# EAGLE schematic Schematic Projeto (EAGLE 9.7.0)
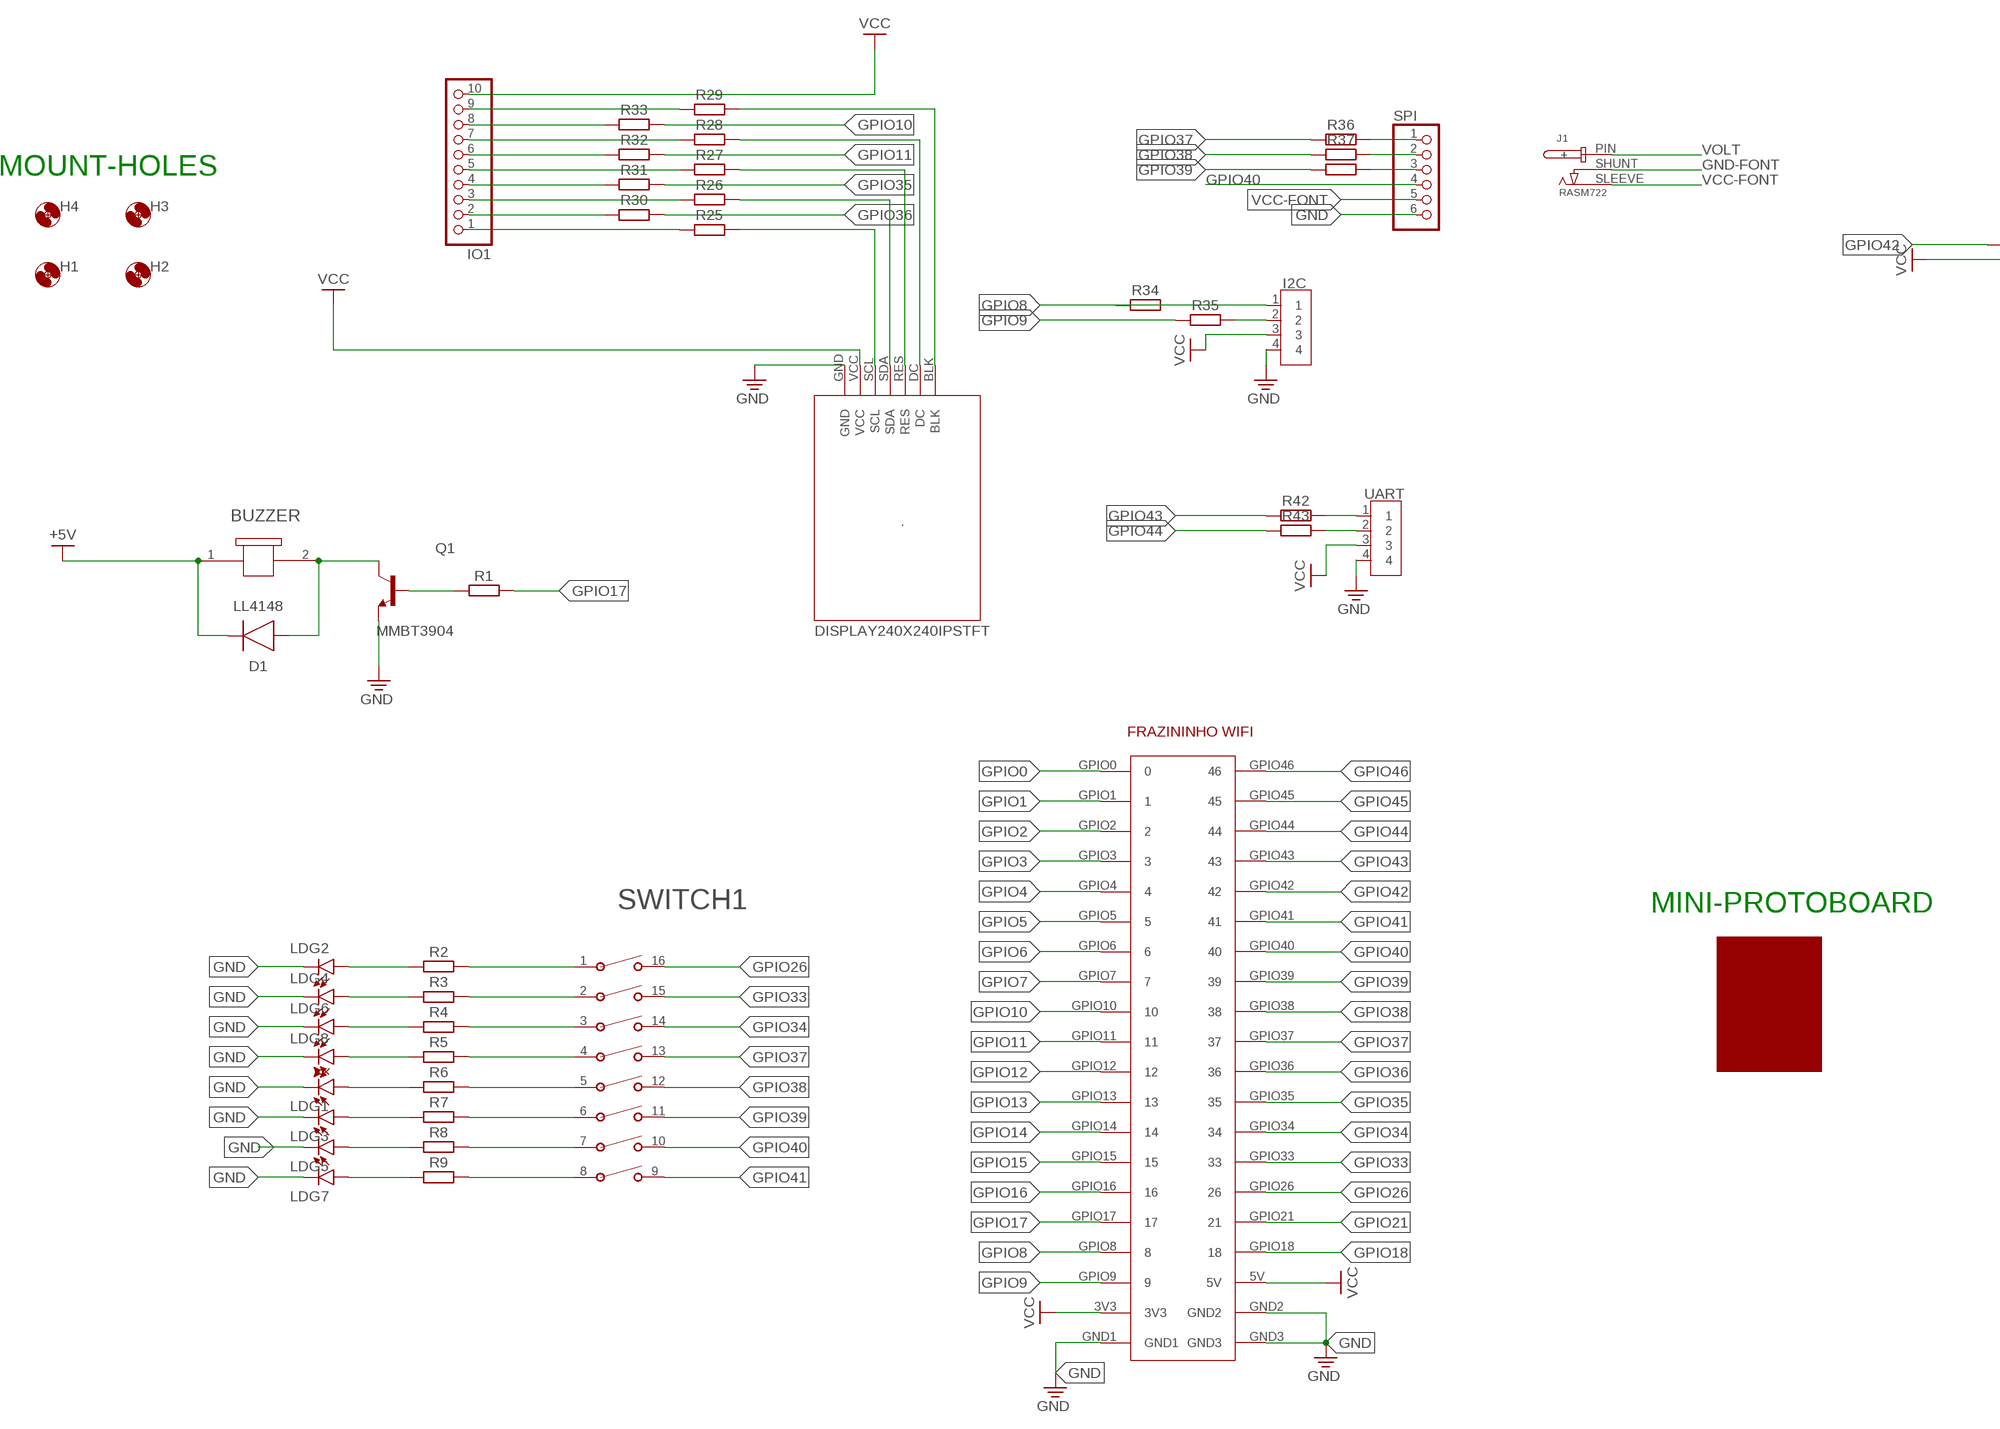
[diagram p0: schematic, sheet 1, part 1 of 2]
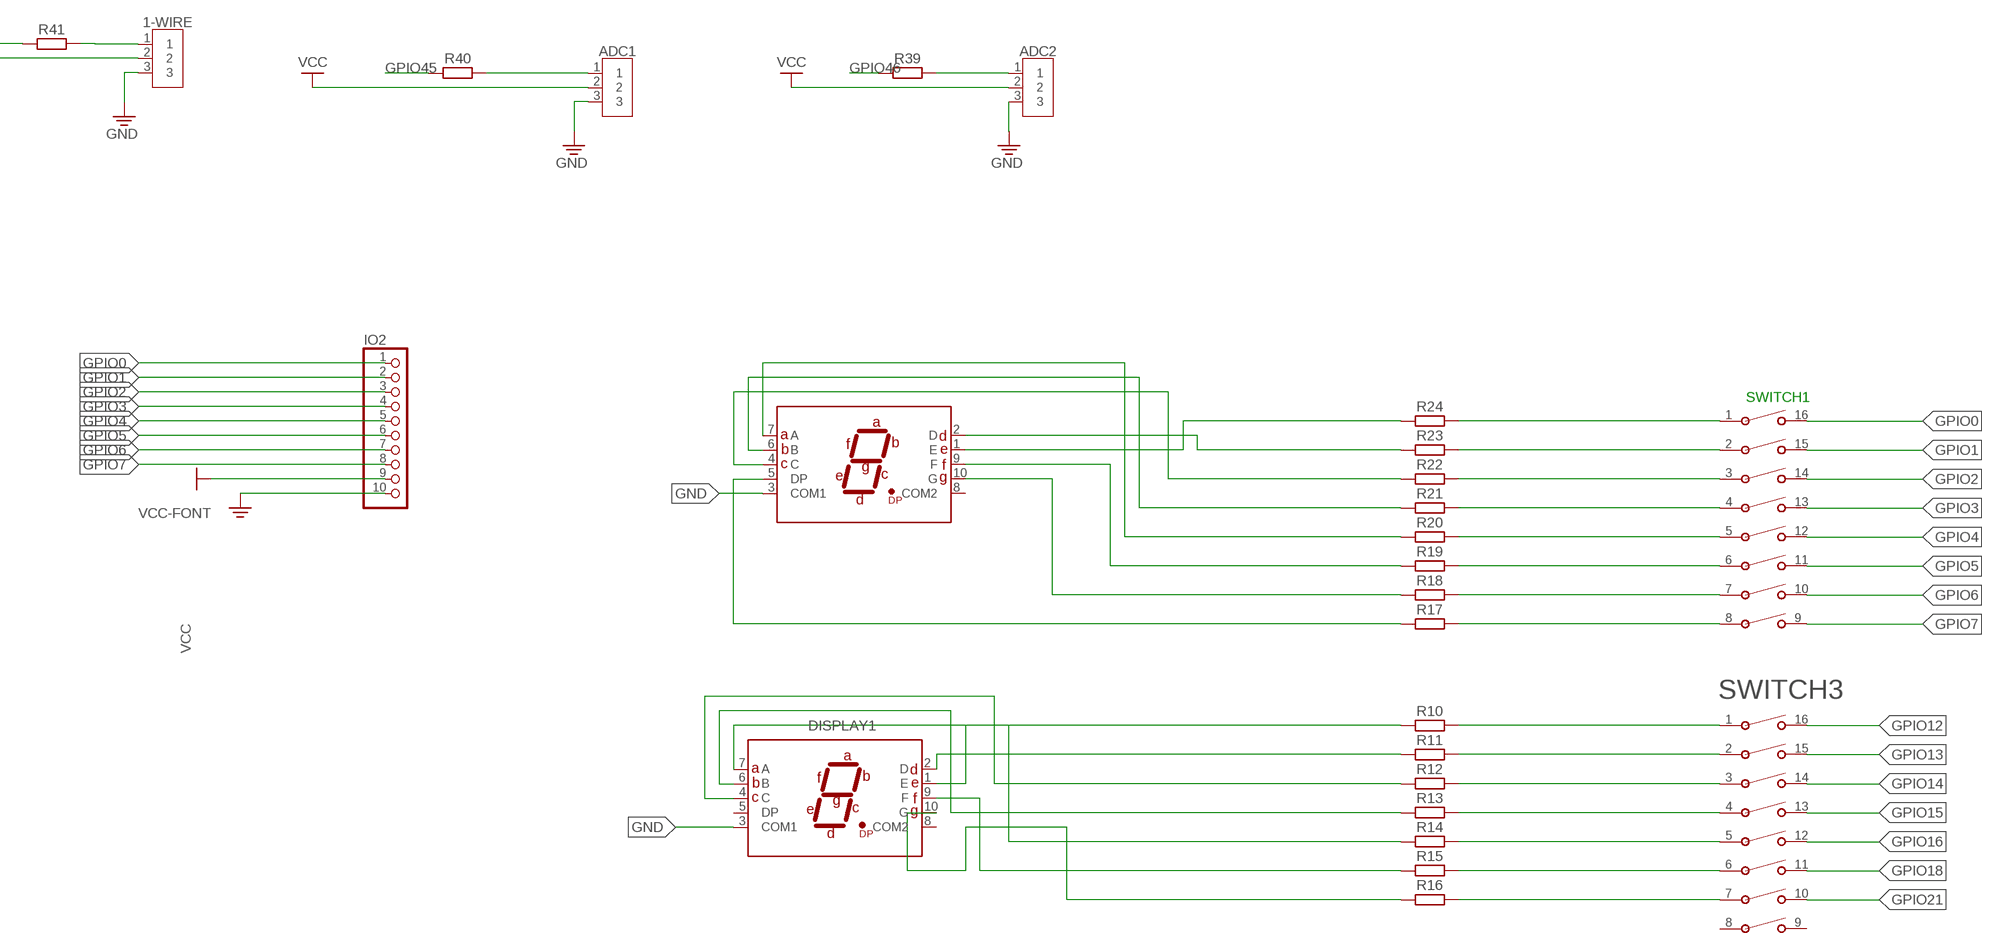
[diagram p1: schematic, sheet 1, part 2 of 2]

## Parts
1-WIRE  2828XX-3282834-3  [TERMBLK_254-3N]
.  DISPLAY240X240IPSTFT  [TFT]
ADC1  2828XX-3282834-3  [TERMBLK_254-3N]
ADC2  2828XX-3282834-3  [TERMBLK_254-3N]
BUZZER  PB-09N23P-03QPB-09N23P-03Q_MAL  [PB-09N23P-03Q_MAL]
D1  LL4148  DIODE_LL4148_SOD-80  [DIOMELF3516]
DISPLAY1  ACSA03-41  ACSA03-41SRWA-F01  [ACSA0341SRWAF01]
DISPLAY2  ACSA03-41  ACSA03-41SRWA-F01  [ACSA0341SRWAF01]
H1  MOUNT-HOLE2.2  [2,2]
H2  MOUNT-HOLE2.2  [2,2]
H3  MOUNT-HOLE2.2  [2,2]
H4  MOUNT-HOLE2.2  [2,2]
I2C  2828XX-4282837-4  [TERMBLK_508-4N]
IO1  PINHD-1X10  [1X10]
IO2  PINHD-1X10  [1X10]
J1  RASM722  [RASM722X]
LDG1  LED_RADIALGREEN  [LEDGR254W60D565H860B_Y]
LDG2  LED_RADIALGREEN  [LEDGR254W60D565H860B_Y]
LDG3  LED_RADIALGREEN  [LEDGR254W60D565H860B_Y]
LDG4  LED_RADIALGREEN  [LEDGR254W60D565H860B_Y]
LDG5  LED_RADIALGREEN  [LEDGR254W60D565H860B_Y]
LDG6  LED_RADIALGREEN  [LEDGR254W60D565H860B_Y]
LDG7  LED_RADIALGREEN  [LEDGR254W60D565H860B_Y]
LDG8  LED_RADIALGREEN  [LEDGR254W60D565H860B_Y]
Q1  MMBT3904  [SOT23]
R1  R_CHIP-0603(1608-METRIC)  [RESC1608X60]
R2  R_CHIP-0603(1608-METRIC)  [RESC1608X60]
R3  R_CHIP-0603(1608-METRIC)  [RESC1608X60]
R4  R_CHIP-0603(1608-METRIC)  [RESC1608X60]
R5  R_CHIP-0603(1608-METRIC)  [RESC1608X60]
R6  R_CHIP-0603(1608-METRIC)  [RESC1608X60]
R7  R_CHIP-0603(1608-METRIC)  [RESC1608X60]
R8  R_CHIP-0603(1608-METRIC)  [RESC1608X60]
R9  R_CHIP-0603(1608-METRIC)  [RESC1608X60]
R10  R_AXIAL-7.2MM-PITCH  [RESAD724W46L381D178B]
R11  R_AXIAL-7.2MM-PITCH  [RESAD724W46L381D178B]
R12  R_AXIAL-7.2MM-PITCH  [RESAD724W46L381D178B]
R13  R_AXIAL-7.2MM-PITCH  [RESAD724W46L381D178B]
R14  R_AXIAL-7.2MM-PITCH  [RESAD724W46L381D178B]
R15  R_AXIAL-7.2MM-PITCH  [RESAD724W46L381D178B]
R16  R_AXIAL-7.2MM-PITCH  [RESAD724W46L381D178B]
R17  R_AXIAL-7.2MM-PITCH  [RESAD724W46L381D178B]
R18  R_AXIAL-7.2MM-PITCH  [RESAD724W46L381D178B]
R19  R_AXIAL-7.2MM-PITCH  [RESAD724W46L381D178B]
R20  R_AXIAL-7.2MM-PITCH  [RESAD724W46L381D178B]
R21  R_AXIAL-7.2MM-PITCH  [RESAD724W46L381D178B]
R22  R_AXIAL-7.2MM-PITCH  [RESAD724W46L381D178B]
R23  R_AXIAL-7.2MM-PITCH  [RESAD724W46L381D178B]
R24  R_AXIAL-7.2MM-PITCH  [RESAD724W46L381D178B]
R25  R_AXIAL-7.2MM-PITCH  [RESAD724W46L381D178B]
R26  R_AXIAL-7.2MM-PITCH  [RESAD724W46L381D178B]
R27  R_AXIAL-7.2MM-PITCH  [RESAD724W46L381D178B]
R28  R_AXIAL-7.2MM-PITCH  [RESAD724W46L381D178B]
R29  R_AXIAL-7.2MM-PITCH  [RESAD724W46L381D178B]
R30  R_AXIAL-7.2MM-PITCH  [RESAD724W46L381D178B]
R31  R_AXIAL-7.2MM-PITCH  [RESAD724W46L381D178B]
R32  R_AXIAL-7.2MM-PITCH  [RESAD724W46L381D178B]
R33  R_AXIAL-7.2MM-PITCH  [RESAD724W46L381D178B]
R34  R_AXIAL-7.2MM-PITCH  [RESAD724W46L381D178B]
R35  R_AXIAL-7.2MM-PITCH  [RESAD724W46L381D178B]
R36  R_AXIAL-7.2MM-PITCH  [RESAD724W46L381D178B]
R37  R_AXIAL-7.2MM-PITCH  [RESAD724W46L381D178B]
R38  R_AXIAL-7.2MM-PITCH  [RESAD724W46L381D178B]
R39  R_AXIAL-7.2MM-PITCH  [RESAD724W46L381D178B]
R40  R_AXIAL-7.2MM-PITCH  [RESAD724W46L381D178B]
R41  R_AXIAL-7.2MM-PITCH  [RESAD724W46L381D178B]
R42  R_AXIAL-7.2MM-PITCH  [RESAD724W46L381D178B]
R43  R_AXIAL-7.2MM-PITCH  [RESAD724W46L381D178B]
SPI  PINHD-1X6  [1X06]
SWITCH1  1-1825006-5SWSO16_386X100P100-L  [SWSO16_386X100P100-L]
SWITCH2  1-1825006-5SWSO16_386X100P100-L  [SWSO16_386X100P100-L]
SWITCH3  1-1825006-5SWSO16_386X100P100-L  [SWSO16_386X100P100-L]
U$1  FRANZININHO-WIFI  [FRANZININHO]
U$2  MINI-PROTOBOARD  [MINI-PROTOBOARD]
UART  2828XX-4282837-4  [TERMBLK_508-4N]

## Nets
+5V: BUZZER.1 D1.1(C)
GND: 1-WIRE.3 ..GND ADC1.3 ADC2.3 DISPLAY1.3(COM1) DISPLAY2.3(COM1) I2C.4 IO2.10 LDG1.2(C) LDG2.2(C) LDG3.2(C) LDG4.2(C) LDG5.2(C) LDG6.2(C) LDG7.2(C) LDG8.2(C) Q1.2(E) SPI.6 U$1.GND1 U$1.GND2 U$1.GND3 UART.4
GND-FONT: J1.SHUNT(-)
GPIO0: IO2.1 SWITCH2.16 U$1.GPIO0
GPIO1: IO2.2 SWITCH2.15 U$1.GPIO1
GPIO2: IO2.3 SWITCH2.14 U$1.GPIO2
GPIO3: IO2.4 SWITCH2.13 U$1.GPIO3
GPIO4: IO2.5 SWITCH2.12 U$1.GPIO4
GPIO5: IO2.6 SWITCH2.11 U$1.GPIO5
GPIO6: IO2.7 SWITCH2.10 U$1.GPIO6
GPIO7: IO2.8 SWITCH2.9 U$1.GPIO7
GPIO8: I2C.1 U$1.GPIO8
GPIO9: R35.1 U$1.GPIO9
GPIO10: R33.2 U$1.GPIO10
GPIO11: R32.2 U$1.GPIO11
GPIO12: SWITCH3.16 U$1.GPIO12
GPIO13: SWITCH3.15 U$1.GPIO13
GPIO14: SWITCH3.14 U$1.GPIO14
GPIO15: SWITCH3.13 U$1.GPIO15
GPIO16: SWITCH3.12 U$1.GPIO16
GPIO17: R1.2 U$1.GPIO17
GPIO18: SWITCH3.11 U$1.GPIO18
GPIO21: SWITCH3.10 U$1.GPIO21
GPIO26: SWITCH1.16 U$1.GPIO26
GPIO33: SWITCH1.15 U$1.GPIO33
GPIO34: SWITCH1.14 U$1.GPIO34
GPIO35: R31.2 U$1.GPIO35
GPIO36: R30.2 U$1.GPIO36
GPIO37: R36.1 SWITCH1.13 U$1.GPIO37
GPIO38: R37.1 SWITCH1.12 U$1.GPIO38
GPIO39: R38.1 SWITCH1.11 U$1.GPIO39
GPIO40: SPI.4 SWITCH1.10 U$1.GPIO40
GPIO41: SWITCH1.9 U$1.GPIO41
GPIO42: R41.1 U$1.GPIO42
GPIO43: R42.1 U$1.GPIO43
GPIO44: R43.1 U$1.GPIO44
GPIO45: R40.1 U$1.GPIO45
GPIO46: R39.1 U$1.GPIO46
N$1: ..SCL R25.2
N$2: BUZZER.2 D1.2(A) Q1.3(C)
N$3: ..SDA R26.2
N$4: Q1.1(B) R1.1
N$5: ..RES R27.2
N$6: R10.2 SWITCH3.1
N$7: ..DC R28.2
N$8: I2C.2 R35.2
N$9: ..BLK R29.2
N$10: DISPLAY2.5(DP) R17.1
N$11: R11.2 SWITCH3.2
N$12: R12.2 SWITCH3.3
N$13: LDG2.1(A) R2.1
N$14: R2.2 SWITCH1.1
N$15: LDG4.1(A) R3.1
N$16: DISPLAY1.1(E) R10.1
N$17: DISPLAY2.1(E) R24.1
N$18: R3.2 SWITCH1.2
N$19: LDG6.1(A) R4.1
N$20: LDG8.1(A) R5.1
N$21: DISPLAY2.2(D) R23.1
N$22: DISPLAY2.4(C) R22.1
N$23: DISPLAY1.2(D) R11.1
N$24: DISPLAY1.4(C) R12.1
N$25: LDG1.1(A) R6.1
N$26: LDG3.1(A) R7.1
N$27: LDG5.1(A) R8.1
N$28: LDG7.1(A) R9.1
N$29: R4.2 SWITCH1.3
N$30: R5.2 SWITCH1.4
N$31: R6.2 SWITCH1.5
N$32: R7.2 SWITCH1.6
N$33: R8.2 SWITCH1.7
N$34: R9.2 SWITCH1.8
N$35: DISPLAY2.6(B) R21.1
N$36: DISPLAY2.7(A) R20.1
N$37: DISPLAY2.9(F) R19.1
N$38: DISPLAY2.10(G) R18.1
N$39: DISPLAY1.6(B) R13.1
N$40: DISPLAY1.7(A) R14.1
N$41: DISPLAY1.9(F) R15.1
N$42: DISPLAY1.10(G) R16.1
N$43: R13.2 SWITCH3.4
N$44: R14.2 SWITCH3.5
N$45: R15.2 SWITCH3.6
N$46: R16.2 SWITCH3.7
N$47: R17.2 SWITCH2.8
N$48: R18.2 SWITCH2.7
N$49: R19.2 SWITCH2.6
N$50: R20.2 SWITCH2.5
N$51: R21.2 SWITCH2.4
N$52: R22.2 SWITCH2.3
N$53: R23.2 SWITCH2.2
N$54: R24.2 SWITCH2.1
N$55: IO1.1 R25.1
N$56: IO1.3 R26.1
N$57: IO1.5 R27.1
N$58: IO1.7 R28.1
N$59: IO1.9 R29.1
N$60: IO1.2 R30.1
N$61: IO1.4 R31.1
N$62: IO1.6 R32.1
N$63: IO1.8 R33.1
N$64: R36.2 SPI.1
N$65: R37.2 SPI.2
N$66: R38.2 SPI.3
N$67: R43.2 UART.2
N$68: ADC2.1 R39.2
N$69: ADC1.1 R40.2
N$70: 1-WIRE.1 R41.2
N$71: R42.2 UART.1
VCC: 1-WIRE.2 ..VCC ADC1.2 ADC2.2 I2C.3 IO1.10 U$1.3V3 U$1.5V UART.3
VCC-FONT: IO2.9 J1.SLEEVE(NEG) SPI.5 ; supply symbol labelled VCC
VOLT: J1.PIN(+)
Unconnected: DISPLAY1.5(DP) DISPLAY1.8(COM2) DISPLAY2.8(COM2) R34.1 R34.2 SWITCH3.8 SWITCH3.9

## Notes on the sheet
- MOUNT-HOLES
- SWITCH1
- MINI-PROTOBOARD

## Library data of the parts
1-WIRE ADC1 ADC2 = Connector:2828XX-3: 3 Position Wire to Board Terminal Block Horizontal with Board Datasheet <https://www.te.com.cn/commerce/DocumentDelivery/DDEController?Action=showdoc&DocId=Catalog+Section%7F1308389_EUROSTYLE_TERMINAL_BLOCKS%7F0607%7Fpdf%7FEnglish%7FENG_CS_1308389_EUROSTYLE_TERMINAL_BLOCKS_0607.pdf%7F2-282837-5>; CATEGORY: Connector; DESCRIPTION: TERM BLK 3P SIDE ENT 2.54mm PCB; MANUFACTURER: TE Connectivity; MPN: 282834-3; OPERATING_TEMPERATURE: -40°C to +105°C; PART_STATUS: Active; ROHS_COMPLIANCE: RoHS Compliant; SERIES: 282834; SUBCATEGORY: Terminal Block; TYPE: Side Wire Entry
. = TFT Display:DISPLAY240X240IPSTFT
BUZZER = buzzer new v2:PB-09N23P-03Q; COPYRIGHT: Copyright (C) 2022 Ultra Librarian. All rights reserved.; MANUFACTURER_PART_NUMBER: PB-09N23P-03Q; MFR_NAME: Mallory Sonalert
D1 = Diode:DIODE_: Diode Rectifier - Popular parts; CATEGORY: Diode; DESCRIPTION: DIODE GEN PURP 100V 200MA SOD80; MANUFACTURER: ON Semiconductor; SUB-CATEGORY: Rectifier
DISPLAY1 DISPLAY2 = Display_LED:ACS*?: Single Digit Numeric Display - 7-SEG, (0.2”, 0.3, 0.4, 0.8”) Character size, RED 10SMD 0.2 inch: Common Anode Datasheet <https://www.kingbrightusa.com/images/catalog/SPEC/ACSA02-41SURKWA-F01.pdf> and Common Cathode Datasheet <https://www.kingbrightusa.com/images/catalog/SPEC/ACSC02-41SURKWA-F01.pdf> 0.3 inch: Common Anode Datasheet <https://www.kingbrightusa.com/images/catalog/SPEC/ACSA03-41SRWA-F01.pdf> and Common Cathode Datasheet <https://www.kingbrightusa.com/images/catalog/SPEC/ACSC03-41SRWA-F01.pdf> 0.4 inch: Common Anode Datasheet <https://www.kingbrightusa.com/images/catalog/SPEC/ACSA04-41SRWA-F01.pdf> and Common Cathode Datasheet <https://www.kingbrightusa.com/images/catalog/SPEC/ACSC04-41SRWA-F01.pdf> 0.8 inch: Common Anode Datasheet <https://www.kingbrightusa.com/images/catalog/SPEC/ACSA08-51SURKWA.pdf> and Common Cathode Datasheet <https://www.kingbrightusa.com/images/catalog/SPEC/ACSC08-51SURKWA.pdf>; CATEGORY: Display; COLOUR: RED; CONFIGURATION: COMMON ANODE; DIGIT: Single; DIGIT_HEIGHT: 0.3inch; MANUFACTURER: Kingbright; MPN: ACSA03-41SRWA-F01; OPERATING_TEMPERATURE: -40°C To +85°C; PART_STATUS: ACTIVE; ROHS_COMPLIANT: COMPLIANT; SERIES: -; SUB_CATEGORY: LED; TYPE: 7-Segment
H1-H4 = holes:MOUNT-HOLE: MOUNTING HOLE with drill center marker
I2C UART = Connector:2828XX-4: 4 Position Wire to Board Terminal Block Horizontal with Board Datasheet <https://www.te.com.cn/commerce/DocumentDelivery/DDEController?Action=showdoc&DocId=Catalog+Section%7F1308389_EUROSTYLE_TERMINAL_BLOCKS%7F0607%7Fpdf%7FEnglish%7FENG_CS_1308389_EUROSTYLE_TERMINAL_BLOCKS_0607.pdf%7F2-282837-5>; CATEGORY: Connector; DESCRIPTION: TERM BLK 4P SIDE ENT 5.08mm PCB; MANUFACTURER: TE Connectivity; MPN: 282837-4; OPERATING_TEMPERATURE: 40°C to +105°C; PART_STATUS: Active; ROHS_COMPLIANCE: RoHS Compliant; SERIES: 283737; SUBCATEGORY: Terminal Block; TYPE: Side Wire Entry
IO1 IO2 = Connector:PINHD-1X10: PIN HEADER; CATEGORY: CONNECTOR; SUB-CATEGORY: PIN-HEADER
J1 = Connector:RASM722: CONN PWR JACK 2.1X5.5MM SOLDER Manufacturer's datasheet <http://www.switchcraft.com/Documents/EDG4.pdf#page=135>; CREATED_BY: PCBLayout.com; DIGI-KEY_PART_NO: RASM722X-ND; MANUFACTURER: Switchcraft Inc.; MPN: RASM722X
LDG1-LDG8 = Library:LED_RADIAL: LED - Generic
Q1 = Transistor:MMBT3904: TRANS NPN 40V 0.2A SOT-23 Manufacturer's datasheet <https://www.onsemi.com/pub/Collateral/PZT3904-D.pdf>; CREATED_BY: PCBLayout.com; DIGIKEY_PART_NUMBER: MMBT3904FSCT-ND; MANUFACTURER: ON Semiconductor; MPN: MMBT3904; PACKAGE: SOT-23-3
R1-R43 = Resistor:R: Resistor Fixed - Generic; CATEGORY: Resistor; SUB-CATEGORY: Fixed
SPI = Connector:PINHD-1X6: PIN HEADER; CATEGORY: CONNECTOR; SUB-CATEGORY: PIN-HEADER
SWITCH1-SWITCH3 = Switches:1-1825006-5; BUILT_BY: EMA_UL_Team; CATEGORY: DIP & SIP Switches; COPYRIGHT: Copyright (C) 2016 Accelerated Designs. All rights reserved; DESCRIPTION: GDS08S04=DIP SW,SLIDE,SMT; MANUFACTURER_PART_NUMBER: 1-1825006-5; PART_STATUS: active; SERIES: Alcoswitch DIP,Alcoswitch DIP GDS; VENDOR: TE Connectivity
U$1 = Frazininho Symbolo:FRANZININHO-WIFI
U$2 = mini-protoboard:MINI-PROTOBOARD